# EAGLE design MOD-RGB_Rev_B (EAGLE 4.16)
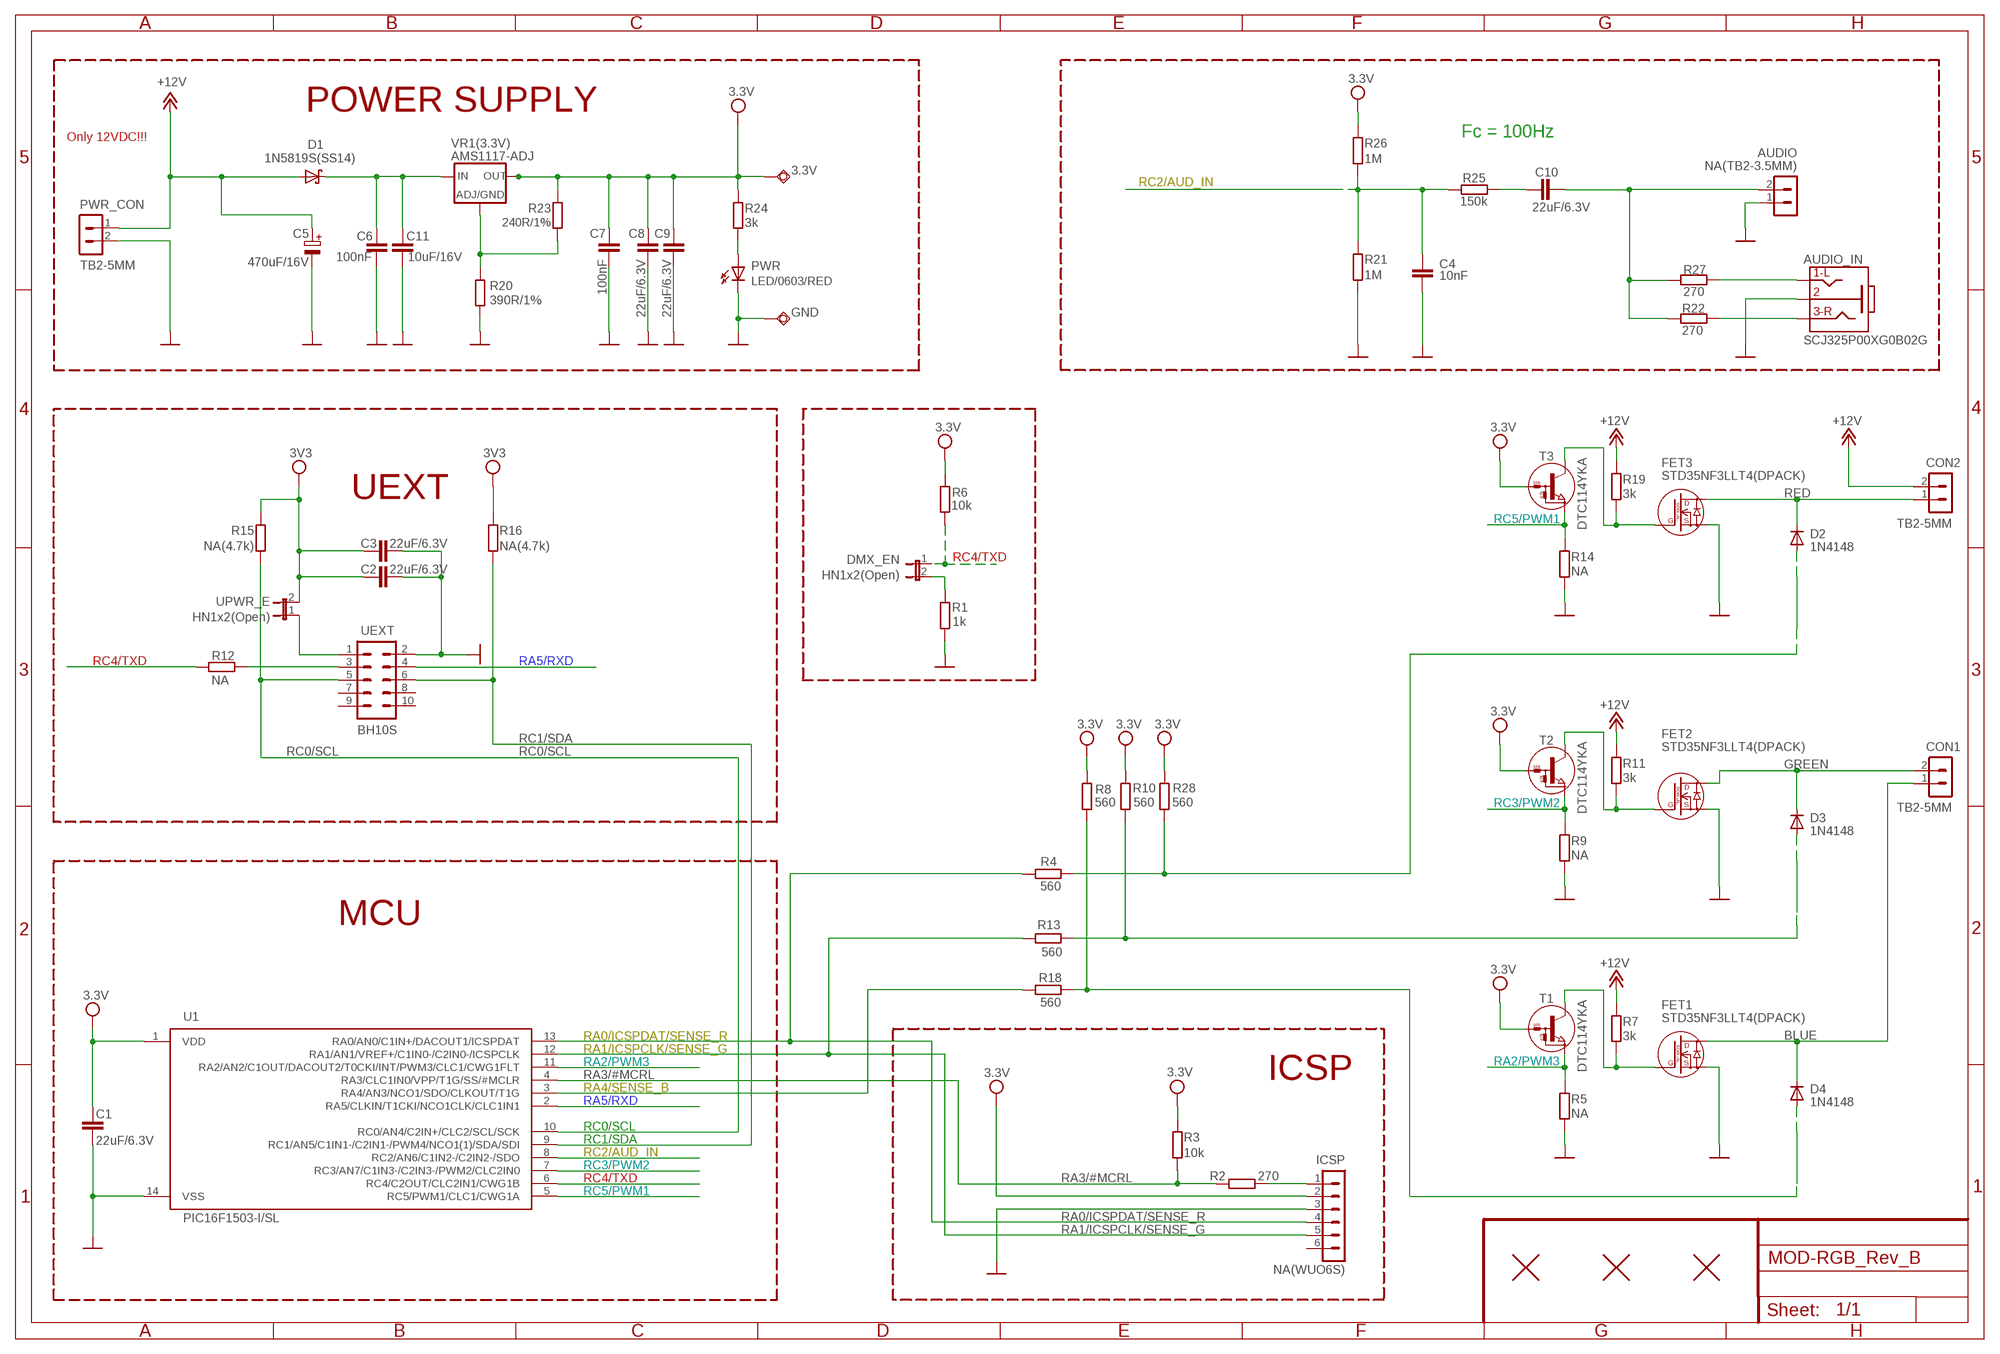
[diagram p0: schematic, sheet 1]

## Parts
3.3V  TESTPAD3  [TEST_PAD40/70/SQUARE]
AUDIO  NA(TB2-3.5MM)  CON2-DG350-3.5_2P(TB2-3.5MM)  [DG350-3.5_2P]
AUDIO_IN  SCJ325P00XG0B02G  JACK-3PINSCJ325P00XG0B02G  [PHONE_JACK-SMD]
C1  22uF/6.3V  C-EUC0603_DWS  [C0603_DWS]
C2  22uF/6.3V  C-EUC0603_DWS  [C0603_DWS]
C3  22uF/6.3V  C-EUC0603_DWS  [C0603_DWS]
C4  10nF  C-EUC0603_DWS  [C0603_DWS]
C5  470uF/16V  CP3.81MM  [3.81MMELEKTROLIT]
C6  100nF  C-EUC0603_DWS  [C0603_DWS]
C7  100nF  C-EUC0603_DWS  [C0603_DWS]
C8  22uF/6.3V  C-EUC0603_DWS  [C0603_DWS]
C9  22uF/6.3V  C-EUC0603_DWS  [C0603_DWS]
C10  22uF/6.3V  C-EUC0603_DWS  [C0603_DWS]
C11  10uF/16V  C-EUC0805_5MIL_DWS  [C0805_5MIL_DWS]
CON1  TB2-5MM  CON2-DG306-5.0_2P(TB2-5MM)  [DG306-5.0_2P]
CON2  TB2-5MM  CON2-DG306-5.0_2P(TB2-5MM)  [DG306-5.0_2P]
D1  1N5819S(SS14)  SCHOTKKY7.62SS2  [MLL-41]
D2  1N4148  DSMD  [MINI-MELF]
D3  1N4148  DSMD  [MINI-MELF]
D4  1N4148  DSMD  [MINI-MELF]
DMX_EN  HN1x2(Open)  JP1E  [JP1]
FET1  STD35NF3LLT4(DPACK)  N-MOS+DIOD/STD35NF3LLT4(DPACK)  [TO-252(DPACK)]
FET2  STD35NF3LLT4(DPACK)  N-MOS+DIOD/STD35NF3LLT4(DPACK)  [TO-252(DPACK)]
FET3  STD35NF3LLT4(DPACK)  N-MOS+DIOD/STD35NF3LLT4(DPACK)  [TO-252(DPACK)]
FID1  FIDUCIAL1X2  [FIDUCIAL-1X2]
FID2  FIDUCIAL1X2  [FIDUCIAL-1X2]
FID3  FIDUCIAL1X2  [FIDUCIAL-1X2]
GND  TESTPAD3  [TEST_PAD40/70/SQUARE]
ICSP  NA(WUO6S)  CON6WUO6S  [WU06S]
PWR  LED/0603/RED  LED0603DWS  [LED-0603]
PWR_CON  TB2-5MM  CON2-DG306-5.0_2P(TB2-5MM)  [DG306-5.0_2P]
R1  1k  R-EU_R0603_5MIL_DWS  [R0603_5MIL_DWS]
R2  270  R-EU_R0603_5MIL_DWS  [R0603_5MIL_DWS]
R3  10k  R-EU_R0603_5MIL_DWS  [R0603_5MIL_DWS]
R4  560  R-EU_R0603_5MIL_DWS  [R0603_5MIL_DWS]
R5  NA  R-EU_R0603_5MIL_DWS  [R0603_5MIL_DWS]
R6  10k  R-EU_R0603_5MIL_DWS  [R0603_5MIL_DWS]
R7  3k  R-EU_R0603_5MIL_DWS  [R0603_5MIL_DWS]
R8  560  R-EU_R0603_5MIL_DWS  [R0603_5MIL_DWS]
R9  NA  R-EU_R0603_5MIL_DWS  [R0603_5MIL_DWS]
R10  560  R-EU_R0603_5MIL_DWS  [R0603_5MIL_DWS]
R11  3k  R-EU_R0603_5MIL_DWS  [R0603_5MIL_DWS]
R12  NA  R-EU_R0603_5MIL_DWS  [R0603_5MIL_DWS]
R13  560  R-EU_R0603_5MIL_DWS  [R0603_5MIL_DWS]
R14  NA  R-EU_R0603_5MIL_DWS  [R0603_5MIL_DWS]
R15  NA(4.7k)  R-EU_R0603_5MIL_DWS  [R0603_5MIL_DWS]
R16  NA(4.7k)  R-EU_R0603_5MIL_DWS  [R0603_5MIL_DWS]
R18  560  R-EU_R0603_5MIL_DWS  [R0603_5MIL_DWS]
R19  3k  R-EU_R0603_5MIL_DWS  [R0603_5MIL_DWS]
R20  390R/1%  R-EU_R0603_5MIL_DWS  [R0603_5MIL_DWS]
R21  1M  R-EU_R0603_5MIL_DWS  [R0603_5MIL_DWS]
R22  270  R-EU_R0603_5MIL_DWS  [R0603_5MIL_DWS]
R23  240R/1%  R-EU_R0603_5MIL_DWS  [R0603_5MIL_DWS]
R24  3k  R-EU_R0603_5MIL_DWS  [R0603_5MIL_DWS]
R25  150k  R-EU_R0603_5MIL_DWS  [R0603_5MIL_DWS]
R26  1M  R-EU_R0603_5MIL_DWS  [R0603_5MIL_DWS]
R27  270  R-EU_R0603_5MIL_DWS  [R0603_5MIL_DWS]
R28  560  R-EU_R0603_5MIL_DWS  [R0603_5MIL_DWS]
T1  DTC114YKA  DIGITAL_TRANSISTORS-NPNDTC114YKA  [SOT-23]
T2  DTC114YKA  DIGITAL_TRANSISTORS-NPNDTC114YKA  [SOT-23]
T3  DTC114YKA  DIGITAL_TRANSISTORS-NPNDTC114YKA  [SOT-23]
U1  PIC16F1503-I/SL  PIC16F1503  [SOIC14]
UEXT  BH10S  ML10  [ML10-MALE]
UPWR_E  HN1x2(Open)  JP1E  [JP1]
VR1(3.3V)  AMS1117-ADJ  LM1117  [SOT223]

## Nets
+12V: C5.2(+) CON2.2 D1.A PWR_CON.1 R7.2 R11.2 R19.2
ADJ/GND: R20.2 R23.1 VR1(3.3V).1(ADJ/GND)
BLUE: CON1.1 D4.C(K) FET1.2(D)
GND: AUDIO.1 AUDIO_IN.1 C1.2 C2.2 C3.2 C4.1 C5.1(-) C6.2 C7.2 C8.2 C9.2 C11.2 FET1.3(S) FET2.3(S) FET3.3(S) GND.P$1(PP) ICSP.3 PWR.C PWR_CON.2 R1.1 R5.1 R9.1 R14.1 R20.1 R21.1 U1.14(VSS) UEXT.2
GREEN: CON1.2 D3.C(K) FET2.2(D)
N$1: FET3.1(G) R19.1 T3.3(C)
N$2: C6.1 C11.1 D1.K(C) VR1(3.3V).3(IN)
N$3: FET2.1(G) R11.1 T2.3(C)
N$4: FET1.1(G) R7.1 T1.3(C)
N$5: UEXT.1 UPWR_E.1
N$6: DMX_EN.2 R1.2
N$7: R12.1 UEXT.3
N$8: D2.A R4.1 R28.1
N$9: C10.2 R25.1
N$10: AUDIO.2 C10.1 R22.2 R27.1
N$11: AUDIO_IN.2 R22.1
N$12: AUDIO_IN.5 R27.2
N$13: ICSP.1 R2.1
N$30: PWR.A R24.1
RA0/ICSPDAT/SENSE_R: ICSP.4 R4.2 U1.13(RA0/AN0/C1IN+/DACOUT1/ICSPDAT)
RA1/ICSPCLK/SENSE_G: ICSP.5 R13.2 U1.12(RA1/AN1/VREF+/C1IN0-/C2IN0-/ICSPCLK)
RA2/PWM3: R5.2 T1.2(E) U1.11(RA2/AN2/C1OUT/DACOUT2/T0CKI/INT/PWM3/CLC1/CWG1FLT)
RA3/#MCRL: R2.2 R3.2 U1.4(RA3/CLC1IN0/VPP/T1G/SS/#MCLR)
RA4/SENSE_B: R18.2 U1.3(RA4/AN3/NCO1/SDO/CLKOUT/T1G)
RA4/SENSE_G: D3.A R10.1 R13.1
RA5/RXD: U1.2(RA5/CLKIN/T1CKI/NCO1CLK/CLC1IN1) UEXT.4
RC0/SCL: R15.1 U1.10(RC0/AN4/C2IN+/CLC2/SCL/SCK) UEXT.5
RC1/SDA: R16.1 U1.9(RC1/AN5/C1IN1-/C2IN1-/PWM4/NCO1(1)/SDA/SDI) UEXT.6
RC2/AUD_IN: C4.2 R21.2 R25.2 R26.1 U1.8(RC2/AN6/C1IN2-/C2IN2-/SDO)
RC2/SENSE_B: D4.A R8.1 R18.1
RC3/PWM2: R9.2 T2.2(E) U1.7(RC3/AN7/C1IN3-/C2IN3-/PWM2/CLC2IN0)
RC4/TXD: DMX_EN.1 R6.1 R12.2 U1.6(RC4/C2OUT/CLC2IN1/CWG1B)
RC5/PWM1: R14.2 T3.2(E) U1.5(RC5/PWM1/CLC1/CWG1A)
RED: CON2.1 D2.C(K) FET3.2(D)
VCC: 3.3V.P$1(PP) C1.1 C2.1 C3.1 C7.1 C8.1 C9.1 ICSP.2 R3.1 R6.2 R8.2 R10.2 R15.2 R16.2 R23.2 R24.2 R26.2 R28.2 T1.1(B) T2.1(B) T3.1(B) U1.1(VDD) UPWR_E.2 VR1(3.3V).2(OUT) VR1(3.3V).4(RAD) ; supply symbol labelled 3.3V, 3V3
Unconnected: ICSP.6 UEXT.7 UEXT.8 UEXT.9 UEXT.10

## Notes on the sheet
- POWER SUPPLY
- Only 12VDC!!! | Fc = 100Hz
- UEXT
- MCU
- ICSP

## Library data of the parts
3.3V GND = gogo:TESTPAD: drill 40mils, diameter 70mils
AUDIO CON1 CON2 PWR_CON = Penko:CON2
AUDIO_IN = gogo:JACK-3PIN
C1-C4 C6-C11 = rcl:C-EU: CAPACITOR, European symbol
C5 = DOUBLE-SIDE:CP: POLARIZED CAPACITOR
D1 = gogo:SCHOTKKY7.62SS
D2-D4 = DOUBLE-SIDE:D: DIODES
DMX_EN UPWR_E = jumper:JP1E: JUMPER
FET1-FET3 = Penko:N-MOS+DIOD
FID1-FID3 = SparkFunEagle-6-6-07:FIDUCIAL: Fiducial Alignment Points Various fiducial points for machine vision alignment.
ICSP = Penko:CON6: CONNECTORS - 6 PINS
PWR = DOUBLE-SIDE:LED
R1-R16 R18-R28 = rcl:R-EU_: RESISTOR, European symbol
T1-T3 = OLIMEX_DISCRET:DIGITAL_TRANSISTORS-NPN: DTC114YKA Digital Transistor - NPN
U1 = OLIMEX_IC:PIC16F1503
UEXT = con-harting-ml:ML10: HARTING
VR1(3.3V) = arm:LM1117

## Net classes
1 PWR: width 0.203 mm, drill 0.076 mm, clearance 0.4 mm

## Board
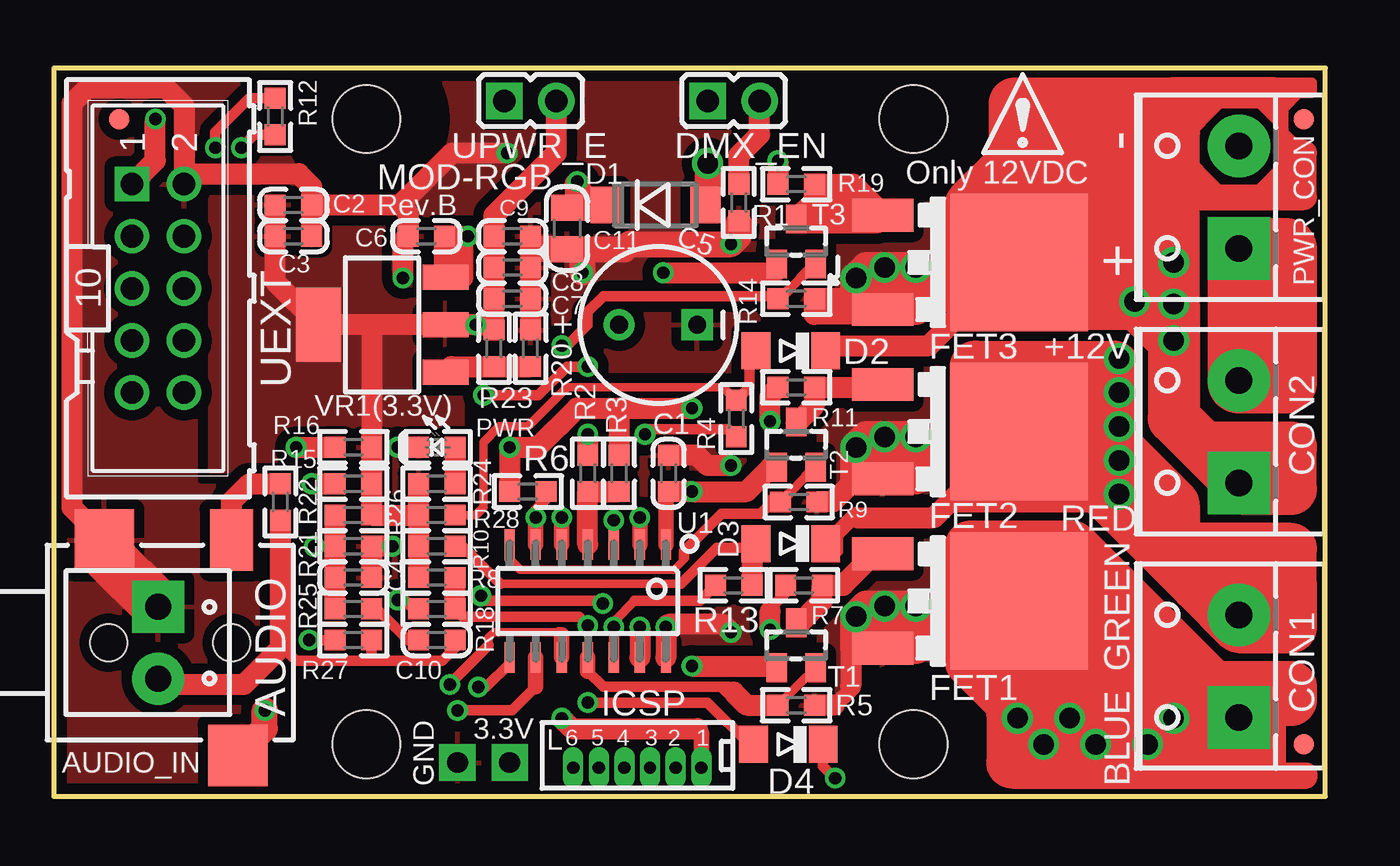
[diagram p1: board, top side]
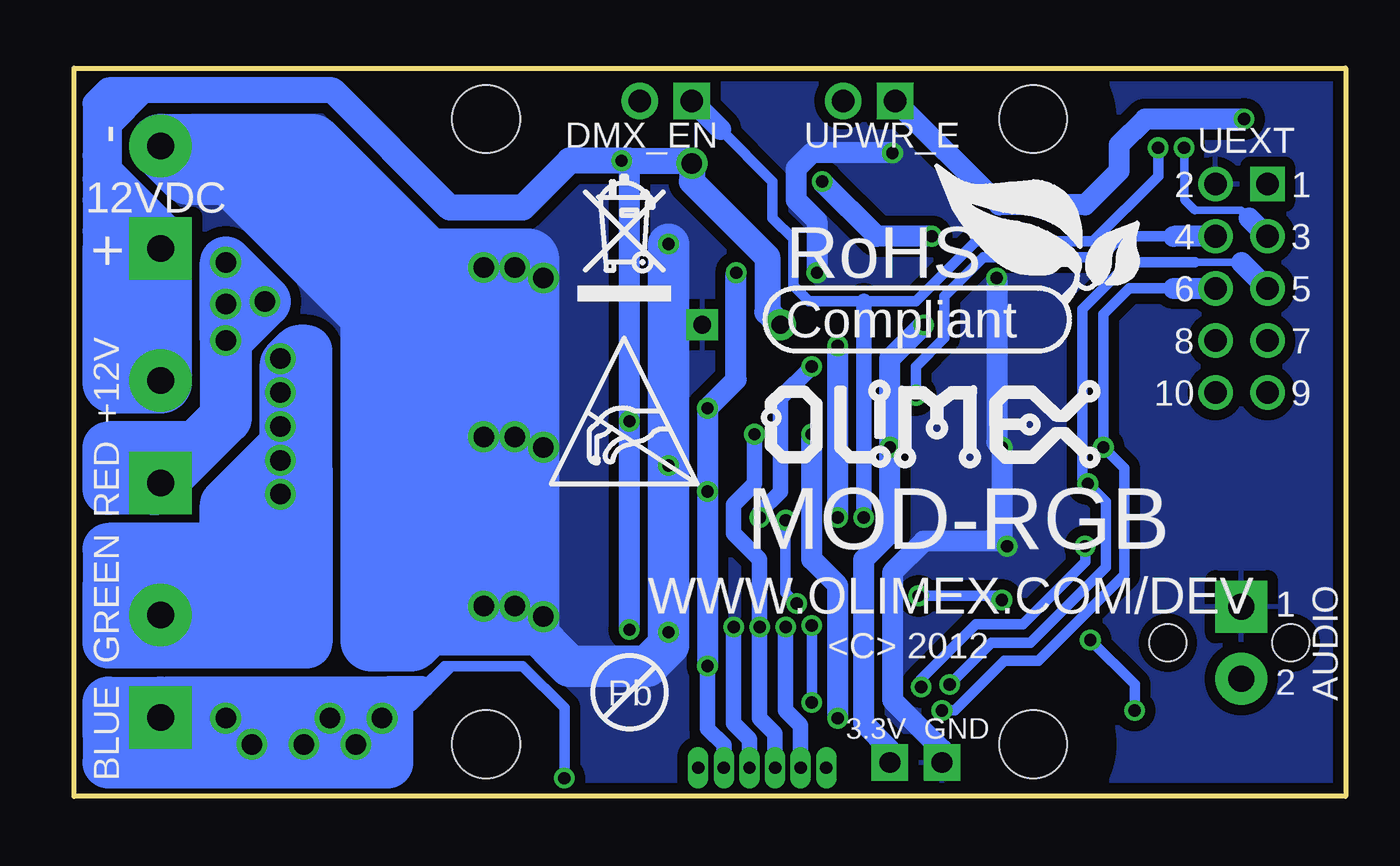
[diagram p2: board, bottom side, seen from below]

Size 62 x 35.5 mm. Coordinates in mm from the lower left corner, seen from the top.
Outline: 0,0 62,0 62,35.5 0,35.5 0,0
Copper layers (1+16): Top 0.035mm / dielectric 1.5mm / Bottom 0.035mm
Design rules "default": minimum track width 10mil, minimum drill 23mil, track to track 10mil, track to pad 10mil, pad to pad 10mil, via to via 10mil, smd to smd 1mil, copper to edge 10mil, drill to drill 8mil, minimum pad ring 8mil, minimum via ring 8mil, stop-mask expansion 4mil, vias tented up to drill 30mil, thermal gap 20mil
Holes 3.3 mm at 15.24,33.02 15.24,2.54 41.91,33.02 41.91,2.54
tRestrict: area 11.8,-0.9 to 18.7,6; area 11.8,29.6 to 18.7,36.4; area 38.5,29.6 to 45.3,36.4; area 38.5,-0.9 to 45.3,6
bRestrict: area 11.8,-0.9 to 18.7,6; area 11.8,29.6 to 18.7,36.4; area 38.5,29.6 to 45.3,36.4; area 38.5,-0.9 to 45.3,6; 1 lines

### Footprints (pad centres in the part's own frame; a part is rotated, then mirrored left to right if it is on the bottom)
TEST_PAD40/70/SQUARE = drill 1.016 pad 1.778 square: P$1 0,0
DG350-3.5_2P = drill 1.27 pad 2.54 square: 1 -1.75,0 | drill 1.27 pad 2.54 round: 2 1.75,0
PHONE_JACK-SMD = smd 2.9 x 3: 1 -0.2,5; 5 6.3,-5.5 | smd 2.1 x 3: 2 6,5 | hole 1.8: 0,0; 6,0
C0603_DWS = smd 1.016 x 1.016: 1 -0.889,0; 2 0.889,0
3.81MMELEKTROLIT = drill 0.864 pad 1.524 square: 1 -1.27,0 | drill 0.864 pad 1.524 round: 2 2.54,0
C0805_5MIL_DWS = smd 1.27 x 1.524: 1 -1.016,0; 2 1.016,0
DG306-5.0_2P = drill 1.3 pad 3.048 square: 1 -2.5,0 | drill 1.3 pad 3.048 round: 2 2.5,0
MLL-41 = smd 1.45 x 1.8: A 2.445,0; K -2.445,0
MINI-MELF = smd 1.4 x 1.8: A 1.7,0; C -1.7,0
JP1 = drill 1.1 pad 1.778 square: 1 0,-1.27 | drill 1.1 pad 1.778 round: 2 0,1.27
TO-252(DPACK) = smd 1.6 x 3: 1 -2.3,-1.5; 3 2.3,-1.5 | smd 6.7 x 6.7: 2 0,5.15
FIDUCIAL-1X2 = smd 1 x 1: 1 0,0
WU06S = drill 0.6 pad 0.991 long: 1 -3.125,0; 2 -1.875,0; 3 -0.625,0; 4 0.625,0; 5 1.875,0; 6 3.125,0
LED-0603 = smd 1.016 x 1.016: A 0.889,0; C -0.889,0
R0603_5MIL_DWS = smd 1.016 x 1.016: 1 -0.889,0; 2 0.889,0
SOT-23 = smd 1 x 1.4: 1 -0.95,-1.1; 2 0.95,-1.1; 3 0,1.1
SOIC14 = smd 0.5 x 1.5: 1 -3.81,-2.75; 2 -2.54,-2.75; 3 -1.27,-2.75; 4 0,-2.75; 5 1.27,-2.75; 6 2.54,-2.75; 7 3.81,-2.75; 8 3.81,2.75; 9 2.54,2.75; 10 1.27,2.75; 11 0,2.75; 12 -1.27,2.75; 13 -2.54,2.75; 14 -3.81,2.75
ML10-MALE = drill 1.1 pad 1.676 square: 1 -5.08,-1.27 | drill 1.1 pad 1.676 round: 2 -5.08,1.27; 3 -2.54,-1.27; 4 -2.54,1.27; 5 0,-1.27; 6 0,1.27; 7 2.54,-1.27; 8 2.54,1.27; 9 5.08,-1.27; 10 5.08,1.27
SOT223 = smd 1.219 x 2.235: 1 -2.311,-3.099; 2 0,-3.099; 3 2.311,-3.099 | smd 3.6 x 2.2: 4 0,3.099

### Placement (x,y rotation side)
3.3V  22.23,1.65 180 top
AUDIO  5.08,7.49 270 top
AUDIO_IN  2.67,7.49 0 top
C1  29.97,15.75 90 top
C2  11.68,28.83 0 top
C3  11.68,27.3 0 top
C4  14.61,10.67 180 top
C5  30.1,22.99 180 top
C6  18.16,27.3 180 top
C7  22.35,24.26 0 top
C8  22.35,25.78 0 top
C9  22.35,27.3 0 top
C10  18.67,7.62 180 top
C11  25.02,27.69 270 top
CON1  57.78,6.35 90 top
CON2  57.78,17.78 90 top
D1  29.34,28.83 0 top
D2  35.94,21.72 180 top
D3  35.94,12.32 180 top
D4  35.81,2.54 180 top
DMX_EN  33.15,33.91 270 top
FET1  41.91,9.53 270 top
FET2  41.91,17.78 270 top
FET3  41.91,26.04 270 top
FID1  3.17,33.02 0 top
FID2  60.96,2.54 0 top
FID3  60.96,33.02 0 top
GND  19.68,1.65 180 top
ICSP  28.45,1.4 180 top
PWR  18.67,17.02 0 top
PWR_CON  57.78,29.21 90 top
R1  33.4,28.96 90 top
R2  26.04,15.75 270 top
R3  27.56,15.75 270 top
R4  33.27,18.41 270 top
R5  36.2,4.45 180 top
R6  23.11,14.86 180 top
R7  36.58,10.29 180 top
R8  18.67,10.67 180 top
R9  36.32,14.35 180 top
R10  18.67,12.19 180 top
R11  36.2,19.94 180 top
R12  10.79,33.15 270 top
R13  33.15,10.29 180 top
R14  36.2,24.26 180 top
R15  14.61,15.24 0 top
R16  14.61,17.02 0 top
R18  18.67,9.14 180 top
R19  36.2,29.84 180 top
R20  23.24,21.84 270 top
R21  14.61,12.19 180 top
R22  11.05,14.35 270 top
R23  21.46,21.84 90 top
R24  18.67,15.24 180 top
R25  14.61,9.14 180 top
R26  14.61,13.72 0 top
R27  14.61,7.62 180 top
R28  18.67,13.72 180 top
T1  36.2,7.37 0 top
T2  36.2,17.14 0 top
T3  36.2,27.05 0 top
U1  26.04,9.53 180 top
U$1  [ESD_SYMBOL]  38.73,15.24 0 bottom
U$2  [RECYCLE_BIN1/8]  37.47,24.13 0 bottom
U$3  [PB_SMALL]  34.92,5.08 0 bottom
U$4  [OLIMEX1_V]  10.79,15.88 0 bottom
U$5  [ATTENTION]  45.34,31.37 0 top
U$6  [ROHS]  27.3,22.35 0 bottom
UEXT  5.08,24.77 270 top
UPWR_E  23.24,33.91 270 top
VR1(3.3V)  16,22.99 90 top

### Tracks (layer width: path | path; a pad name or v marks a point on that pad's centre or on a via)
+12V  (via drill 0.6, 1)
  Top 0.508: 34.92,9.02 34.92,9.14 35.69,9.91 R7.2
  Top 1.016: v35.31,30.99 R19.2 | v34.92,8.13 34.92,9.02 | v34.92,18.29 34.92,19.56 R11.2
  Top 1.27: D1.A 31.88,28.73 v31.88,30.86
  Top 3.048: PWR_CON.1 57.78,26.67 | 57.78,20.19 57.78,26.67 | CON2.2 57.78,20.19 | 57.78,26.67 60.07,26.67 60.07,20.19 57.78,20.19
  Bottom 1.016: v34.92,8.13 v34.92,18.29 34.92,30.99
  Bottom 1.27: 60.07,26.42 60.96,26.42 60.96,27.56 | 60.96,31.24 60.96,30.1 | 60.96,30.1 60.96,29.08 | 60.96,29.08 60.96,27.56 | 60.33,34.42 60.96,33.78 60.96,31.24 | 58.67,34.42 49.4,34.42 43.69,28.7 40.13,28.7 37.85,30.99 v35.31,30.99 34.92,30.99 32,30.99 v31.88,30.86 31.88,29.97 28.19,26.29 28.19,23.62 C5.2 | 58.67,34.42 60.33,34.42 | 60.96,27.56 59.44,27.56 60.96,29.08 | 60.96,30.1 58.29,27.43 | 60.33,30.61 60.96,31.24 | 60.33,30.61 56.9,27.18 | 60.33,34.42 60.33,32.77 | 60.33,32.77 60.33,30.61 | 58.67,34.42 60.33,32.77
  Bottom 3.048: 57.78,26.67 PWR_CON.1 | 57.78,20.19 57.78,26.67 | 57.78,20.19 CON2.2 | 57.78,26.67 60.07,26.67 60.07,26.42 60.07,20.19 57.78,20.19
ADJ/GND
  Top 1.016: VR1(3.3V).1 19.38,20.95 R23.1 R20.2
BLUE  (via drill 0.6, 1)
  Top 0.508: D4.C 37.51,1.48 v38.1,0.89
  Top 1.016: 58.8,1.65 58.8,1.14 | 58.8,1.14 61.09,1.14 61.09,0.89 58.8,0.89 58.8,1.14 | 46.74,4.06 v46.99,3.81
  Top 2.54: CON1.1 52.11,9.53 FET1.2 44.7,9.53 44.7,9.65 | 44.7,9.65 44.7,12.19 49.66,12.19 54.1,7.75 | 54.1,7.75 55.63,6.22 | 55.63,6.22 56.52,5.33 60.33,5.33 60.33,4.7 58.8,4.7 58.8,4.06 | 58.8,4.06 58.8,1.65 46.74,1.65 46.74,4.06 | 45.09,6.22 44.7,6.6 44.7,9.65 | 45.09,6.22 46.74,4.57 46.74,4.06 | 54.1,7.75 48.39,7.75 | 45.09,6.22 55.63,6.22 | 46.74,4.06 58.8,4.06
  Bottom 0.508: 44.96,5.33 43.94,6.35 43.59,6.35 | 43.59,6.35 40.13,6.35 38.1,4.32 v38.1,0.89 | 43.59,6.35 44.6,5.33 | v53.34,2.54 v50.8,2.54 v48.26,2.54 | v46.99,3.81 v49.53,3.81 53.34,3.81 v53.34,2.54 | v53.34,2.54 56.52,2.54
  Bottom 1.016: 46.86,4.57 45.72,4.57 44.96,5.33 46.74,5.33 46.74,4.7
  Bottom 2.54: CON1.1 57.78,4.57 60.33,4.57 60.33,3.05 | 60.33,3.05 60.33,1.65 46.74,1.65 46.74,3.05 | 46.74,3.05 46.74,4.57 46.86,4.57 57.4,4.57 | 46.74,3.05 54.61,3.05 | 54.61,3.05 v54.61,3.81 | 54.61,3.05 60.33,3.05
GND  (via drill 0.6, 1)
  Top 0.508: v16.76,17.02 PWR.C
  Top 0.762: 38.05,4.45 38.1,4.45 38.86,5.21 38.86,5.38
  Top 1.016: 38.05,4.45 R5.1 | 39.12,7.22 39.12,7.24 38.86,7.24 38.86,5.38 | 39.12,15.48 37.99,14.35 R9.1 | 38.61,24.26 R14.1 37.08,23.5 42.04,23.5 42.04,23.75 | 39.12,24.26 38.61,24.26 | 38.61,24.26 38.61,23.75 | v29.84,8.26 U1.14 v29.84,8.26 | 33.4,27.94 R1.1 | 23.37,26.67 23.24,26.67 | v33.02,16.13 31.88,16.13 31.37,16.64 C1.2 | v33.02,8 32.64,8.38 29.97,8.38 v29.84,8.26 | 23.24,26.67 C9.2 | 23.24,26.67 C8.2 C7.2 R20.1 | v22.1,31.37 19.43,31.37 16.89,28.83 | C2.2 C3.2 | C2.2 12.57,29.72 11.94,30.35 6.35,30.35 | 6.35,30.35 UEXT.2 | AUDIO_IN.1 0.89,14.07 0.89,33.78 1.65,34.54 5.46,34.54 6.35,33.66 6.35,30.35 | v17.02,25.27 17.02,27.05 C6.2 17.27,28.45 16.89,28.83 | C4.1 R21.1 v16.51,12.19 | C2.2 16.89,28.83
  Top 1.27: v25.78,25.53 25.78,26.67 | 25.78,26.67 27.81,26.67 28.07,26.92 v33.02,26.92 33.4,27.3 33.4,27.94 | 25.78,26.67 C11.2 23.37,26.67
  Top 1.524: 40.77,7.22 FET1.3 | 40.77,7.22 42.04,7.22 v42.04,9.27 40.77,9.27 | 40.77,7.22 39.88,7.22 | 39.88,7.22 39.12,7.22 v39.12,8.76 39.62,9.27 39.88,9.27 | 39.88,9.27 v40.51,9.27 40.77,9.27 | 40.77,9.27 40.77,7.22 | 39.88,9.27 39.88,7.22 | 40.77,15.48 FET2.3 | 40.77,15.48 42.04,15.48 v42.04,17.53 40.77,17.53 | 40.77,15.48 39.88,15.48 | 39.88,15.48 39.12,15.48 v39.12,17.02 39.62,17.53 39.88,17.53 | 39.88,17.53 v40.51,17.53 40.77,17.53 | 40.77,17.53 40.77,15.48 | 39.88,17.53 39.88,15.48 | 40.77,23.73 FET3.3 | 40.77,23.73 42.04,23.73 42.04,23.75 v42.04,25.78 40.77,25.78 | 40.77,23.73 39.88,23.73 | 39.88,23.73 39.12,23.73 39.12,24.26 v39.12,25.27 39.62,25.78 39.88,25.78 | 39.88,25.78 v40.51,25.78 40.77,25.78 | 40.77,25.78 40.77,23.73 | 39.88,25.78 39.88,23.73
  Top 2.54: AUDIO.1 5.08,9.27 2.47,11.88 AUDIO_IN.1
  Bottom 0.508: 16.76,12.45 v16.51,12.19
  Bottom 0.762: ICSP.3 29.07,2.78 29.84,3.56 v29.84,8.26
  Bottom 1.016: v22.1,31.37 26.04,31.37 26.8,30.61 26.8,29.08 25.78,28.07 v25.78,25.53 | GND.P$1 19.68,2.29 22.1,4.7 22.1,10.92 20.57,12.45 16.76,12.45 v16.76,17.02 17.02,17.27 v17.02,25.27
  Bottom 1.524: v42.04,17.53 v40.51,17.53 39.62,17.53 v39.12,17.02 42.04,17.02 | v42.04,25.78 v40.51,25.78 39.88,25.78 39.62,25.78 v39.12,25.27 42.04,25.27 | 33.02,22.99 C5.1 | v42.04,9.27 v40.51,9.27 39.62,9.27 v39.12,8.76 42.04,8.76 v42.04,9.27
  Bottom 2.032: v33.02,26.92 33.02,22.99 v33.02,16.13 v33.02,8 33.02,7.37 34.04,6.35 37.85,6.35 39.88,8.38
  Bottom 2.54: 57.78,31.75 PWR_CON.2 | 42.04,17.02 v42.04,17.53
  Bottom 3.048: 39.88,26.16 39.88,25.78 v42.04,25.78 42.04,25.27 v42.04,17.53 | 39.88,26.16 44.83,26.16 | 44.83,26.16 50.42,31.75 57.78,31.75 56.39,30.35 54.36,30.35 | 42.04,17.02 v42.04,9.27 42.04,8.38 | 42.04,8.38 39.88,8.38 39.88,26.16 | 42.04,8.38 44.83,8.38 | 44.83,8.38 44.83,20.83 | 44.83,20.83 44.83,23.24 | 44.83,26.16 44.83,23.24 | 44.83,23.24 53.09,31.5 | 44.83,20.83 47.5,23.5 | 47.5,23.5 54.36,30.35 | 54.36,30.35 55.5,31.5 | 44.83,8.38 45.59,7.62 47.5,7.62 47.5,23.5
  pour Bottom (isolate 0.508, rank 3): -4.83,37.08 64.52,37.08 64.52,-2.54 -4.83,-2.54
  pour Top (isolate 0.508, rank 3): -3.81,35.81 65.15,35.81 65.15,-1.27 -3.81,-1.27
GREEN  (via drill 1)
  Top 0.508: 38.23,12.7 38.23,11.94 | 38.23,12.7 38.23,13.06 38.76,13.59 39.12,13.59 38.23,12.7 | D3.C 37.85,12.32 38.23,12.7
  Top 1.016: 44.96,15.11 44.45,15.11 43.69,14.35 | 39.12,13.59 42.93,13.59 43.69,14.35 | 43.69,14.35 44.96,14.35
  Top 2.54: CON1.2 48.85,17.78 FET2.2 44.96,17.78 44.96,18.03 | 44.96,18.03 44.96,20.95 51.69,20.95 51.69,17.14 54.61,14.22 54.61,12.7 55.24,12.06 60.33,12.06 60.33,10.29 | 60.33,10.29 60.33,8.26 57.78,8.26 55.75,10.29 | 55.75,10.29 50.93,15.11 44.96,15.11 44.96,18.03 | 55.75,10.29 60.33,10.29
  Bottom 1.016: v51.94,21.34 v51.94,19.68 v51.94,18.03 v51.94,16.38 v51.94,14.73
  Bottom 2.54: CON1.2 54.61,12.03 54.61,12.06 | 54.61,12.06 54.61,14.22 51.69,17.14 51.69,21.08 51.05,21.72 50.67,21.72 50.67,16 | 50.67,16 50.67,12.06 | 50.67,8.89 52.7,8.89 | 52.7,8.89 53.98,8.89 | 53.98,8.89 57.78,8.89 | 50.67,16 v51.94,14.73 54.61,12.06 | 50.67,12.06 50.67,8.89 | 50.67,12.06 52.7,12.06 | 50.67,8.89 50.67,7.49 60.33,7.49 60.33,10.29 | 60.33,10.29 60.33,12.06 52.7,12.06 | 52.7,12.06 52.7,10.29 | 52.7,10.29 52.7,8.89 | 53.98,8.89 53.98,13.72 | 52.7,10.29 60.33,10.29
N$1
  Top 1.016: FET3.1 40.5,28.34 40.13,28.7 | 39.5,29.34 38.99,29.84 R19.1 37.08,29.34 | 39.5,29.34 40.13,28.7 | T3.3 37.08,29.04 37.08,29.34 | 40.13,28.7 40.13,27.94 36.2,27.94 | 40.13,28.7 36.96,28.7 | 37.08,29.34 39.5,29.34
N$2  (via drill 0.6)
  Top 1.016: v25.53,29.97 25.53,29.79 | 25.53,28.7 C11.1 | 19.94,27.3 C6.1 19.05,25.3 VR1(3.3V).3 | 19.94,27.3 v20.19,27.3 | 19.94,27.3 19.94,25.3
  Top 1.27: 25.53,29.79 25.53,28.7 26.89,28.7 D1.K
  Bottom 1.016: v25.53,29.97 22.86,27.3 v20.19,27.3
N$3
  Top 1.016: T2.3 36.2,18.16 37.08,19.05 R11.1 40.27,19.94 FET2.1
N$4
  Top 1.016: FET1.1 40.02,11.82 38.48,10.29 R7.1 37.47,9.53 36.2,8.26 T1.3
N$5  (via drill 0.6)
  Top 1.016: UEXT.1 4.95,30.99 v4.95,33.02
  Bottom 1.016: v4.95,33.02 9.78,33.02 11.05,31.75 11.05,30.48 12.7,28.83 16.89,28.83 UPWR_E.1
N$6
  Top 1.016: R1.2 33.4,31.24 34.42,32.26 DMX_EN.2
N$7  (via drill 0.6)
  Top 0.508: v7.87,31.62 7.87,32.38 9.53,34.04 R12.1
  Bottom 0.356: 4.7,28.19 5.08,28.57 7.37,28.57
  Bottom 0.406: 7.37,28.57 7.87,29.08 v7.87,31.62
  Bottom 1.016: UEXT.3 4.7,28.19
N$8
  Top 0.406: R4.1 32.64,19.94 25.02,19.94 23.11,18.03 21.72,18.03 20.95,17.27 20.95,14.1 20.57,13.72 R28.1
  Top 0.508: R4.1 33.91,19.94 33.91,21.08 34.24,21.41 D2.A
N$9
  Top 0.508: R25.1 15.75,9.14 17.27,7.62 C10.2
N$10
  Top 0.508: 11.05,7.37 11.81,6.6 15.49,6.6 | 15.49,6.6 R27.1 | C10.1 19.56,7.24 18.92,6.6 15.49,6.6
  Top 1.016: AUDIO.2 5.36,5.46 9.27,5.46 11.05,7.24 11.05,7.37 R22.2
N$11
  Top 1.016: AUDIO_IN.2 8.67,14.38 9.53,15.24 R22.1
N$12  (via drill 0.6)
  Top 0.508: v12.45,7.62 R27.2
  Top 1.27: AUDIO_IN.5 10.29,3.31 v10.29,4.19
  Bottom 0.508: v12.45,7.62 10.29,5.46 v10.29,4.19
N$13  (via drill 0.6)
  Top 0.762: ICSP.1 31.57,3.1 31.37,3.3
  Top 1.016: v24.77,3.81 25.27,3.3 31.37,3.3 | v26.04,17.65 R2.1
  Bottom 1.016: v24.77,3.81 24.77,10.29 26.04,11.56 v26.04,17.65
N$30
  Top 1.016: PWR.A R24.1
RA0/ICSPDAT/SENSE_R  (via drill 0.6)
  Top 0.508: v28.83,17.65 29.08,17.91 32.89,17.91 R4.2
  Top 1.016: v28.57,8.26 U1.13
  Bottom 0.762: ICSP.4 27.82,3.06 28.57,3.81 v28.57,8.26 28.57,11.56 29.84,12.83 29.84,14.22 28.83,15.24 v28.83,17.65
RA1/ICSPCLK/SENSE_G  (via drill 0.6)
  Top 0.406: 27.3,8.51 28.32,9.53
  Top 0.508: 27.3,8.51 v27.3,8.26 U1.12 | 28.32,9.53 31.5,9.53 R13.2
  Bottom 0.762: ICSP.5 26.57,3.46 27.3,4.19 v27.3,8.26
RA2/PWM3
  Top 0.406: R5.2 36.7,5.84 37.08,5.84
  Top 0.508: 37.08,5.84 37.08,6.21 T1.2 | 26.04,6.1 26.8,5.33 32.54,5.33 | 32.54,5.33 32.89,5.33 33.15,5.08 | 32.54,5.33 32.79,5.08
  Top 0.762: U1.11 26.04,6.1
  Top 1.016: 33.15,5.08 33.78,4.45 R5.2
RA3/#MCRL
  Top 1.016: R3.2 R2.2 U1.4
RA4/SENSE_B  (via drill 0.6)
  Top 0.508: v16.76,9.58 17.09,9.58 17.53,9.14 R18.2 | v20.83,9.78 21.08,9.53 26.64,9.53 v26.77,9.4 | v27.3,13.46 U1.3
  Bottom 0.508: v16.76,9.58 16.97,9.78 v20.83,9.78 | v26.77,9.4 27.3,9.93 v27.3,13.46
RA4/SENSE_G
  Top 0.406: 21.77,10.36 30.58,10.36
  Top 0.508: 34.04,12.11 32.33,12.11 30.58,10.36 | 21.77,10.36 19.94,12.19 R10.1
  Top 1.016: D3.A 34.04,12.11 R13.1
RA5/RXD  (via drill 0.6)
  Top 0.508: v26.04,20.95 25.02,20.95 23.62,19.56 v20.95,19.56
  Top 0.762: v28.57,13.59 U1.2
  Bottom 0.508: 8.38,27.3 10.92,27.3 11.94,26.29 17.65,26.29 19.56,24.38 19.56,22.35 20.95,20.95 v20.95,19.56
  Bottom 0.762: v26.04,20.95 27.56,19.43 27.56,14.86 28.57,13.84 v28.57,13.59
  Bottom 1.016: UEXT.4 8.38,27.3
RC0/SCL  (via drill 0.6)
  Top 0.406: 24.64,8 21.46,8 21.21,7.75 21.21,7.37
  Top 0.508: 24.64,8 24.77,7.87 | v19.3,5.46 21.21,7.37
  Top 0.762: 24.77,7.87 U1.10
  Top 1.016: v12.57,15.24 R15.1
  Bottom 0.356: 7.37,26.04 5.08,26.04
  Bottom 0.508: v19.3,5.46 17.27,7.49 15.37,7.49 11.68,11.18 11.68,14.35 v12.57,15.24 12.83,15.49 12.83,23.75 10.54,26.04 7.37,26.04
  Bottom 1.016: 5.08,26.04 UEXT.5
RC1/SDA  (via drill 0.6)
  Top 0.508: v19.68,4.19 22.35,4.19 23.5,5.33
  Top 0.762: 23.5,5.33 U1.9
  Top 1.016: v11.81,17.02 R16.1
  Bottom 0.508: v19.68,4.19 19.05,4.19 16.64,6.6 14.99,6.6 10.79,10.79 10.79,16 v11.81,17.02 11.81,23.5 10.54,24.77 8.38,24.77
  Bottom 1.016: 8.38,24.77 UEXT.6
RC2/AUD_IN  (via drill 0.6)
  Top 0.508: U1.8 22.23,6.48 21.08,5.33 v20.7,5.33 | R21.2 v12.7,12.19
  Top 1.016: R26.1 R21.2 C4.2 R25.2
  Bottom 0.508: v20.7,5.33 20.7,5.71 18.03,8.38 15.75,8.38 12.7,11.43 v12.7,12.19
RC2/SENSE_B  (via drill 0.6)
  Top 0.508: D4.A 33.91,2.54 31.88,4.57 v26.04,4.57 | R18.1 19.94,8.76 25.6,8.76 v26.04,8.33
  Top 1.016: R18.1 R8.1
  Bottom 0.508: v26.04,8.33 v26.04,4.57
RC3/PWM2
  Top 0.356: 30.25,11.05 30.73,11.53 30.73,11.63
  Top 0.406: 35.81,14.73 36.7,15.62 | 22.23,11.56 22.73,11.05 30.25,11.05
  Top 0.508: T2.2 37.15,16.06 36.7,15.62 | R9.2 35.81,14.73 | 35.05,14.35 34.47,13.77 32.56,13.77 30.73,11.94 30.73,11.63 | U1.7 22.23,11.56
  Top 0.762: 35.05,14.35 R9.2
RC4/TXD  (via drill 0.6)
  Top 0.508: R6.1 24,14.48 23.5,13.97 v23.5,13.59 | v9.14,31.62 9.78,32.26 R12.2
  Top 0.762: U1.6 v23.5,13.59
  Bottom 0.508: 30.48,32.51 27.94,29.97 27.94,28.19 26.92,27.18 26.92,24.89 26.16,24.13 23.5,24.13 20.95,24.13 18.03,27.05 12.32,27.05 9.14,30.23 v9.14,31.62
  Bottom 0.762: v23.5,13.59 23.5,24.13
  Bottom 1.016: 30.48,32.51 DMX_EN.1
RC5/PWM1  (via drill 0.6)
  Top 0.406: 35.79,24.64 36.42,25.27
  Top 0.508: T3.2 37.1,25.95 36.42,25.27 | 35.79,24.64 35.41,24.26 R14.2 35.18,24.26 35.05,24.38 26.8,24.38 26.04,23.62 26.04,22.99 25.02,21.97 v24.77,21.97
  Top 0.762: U1.5 v24.77,13.59
  Bottom 1.016: v24.77,13.59 v24.77,21.97
RED  (via drill 1)
  Top 0.508: 59.94,30.23 59.94,32.38 | 59.94,32.38 59.94,32.64 | 59.94,32.64 59.94,33.27 | 59.94,33.27 59.94,33.53 | 59.94,34.29 59.94,33.53 | 59.44,34.29 59.94,34.29 | 59.94,32.38 60.71,31.62 | 58.93,34.29 59.94,33.27 | 58.29,34.29 59.94,32.64 | 59.69,34.8 61.34,34.8 61.34,34.29 60.71,34.29 | 59.94,34.29 60.71,34.29 | 59.94,33.53 60.71,34.29
  Top 1.016: 44.7,24 42.67,21.97 37.9,21.97 D2.C
  Top 1.27: 54.61,29.21 56.64,29.21 | 56.64,29.21 58.93,29.21 | 58.93,29.21 60.33,29.21 | 60.33,29.21 60.96,29.21 60.96,31.37 60.33,31.37 60.33,30.61 | 54.61,31.24 56.64,29.21 | 60.33,29.21 60.33,30.61 | 58.93,29.21 59.94,30.23 60.33,30.61
  Top 1.524: 54.61,33.78 54.61,34.29 56.64,34.29 | 56.64,34.29 58.29,34.29 58.93,34.29 59.44,34.29 | 54.61,32.26 56.64,34.29
  Top 2.54: 46.86,26.04 FET3.2 | 46.86,26.04 49.15,26.04 | 49.15,26.04 51.31,26.04 | 51.31,26.04 52.96,26.04 | v54.61,26.04 52.96,26.04 | v54.61,26.04 54.61,29.21 54.61,31.24 54.61,32.26 54.61,33.78 52.96,33.78 | 51.31,33.78 52.96,33.78 | 49.15,33.78 51.31,33.78 | 49.15,33.78 46.86,33.78 46.86,30.99 | 46.86,30.99 46.86,26.04 | v54.61,22.23 54.61,18.45 CON2.1 58.08,14.99 58.17,14.99 | v54.61,24 v54.61,22.23 | v54.61,24 v54.61,26.04 | 49.02,24 47.06,24 | 49.02,24 52.83,24 | 52.83,24 v54.61,24 | 52.83,24 v54.61,22.23 | 49.15,33.78 49.15,26.04 | 51.31,26.04 51.31,33.78 | 52.96,26.04 52.96,33.78 | 46.86,30.99 44.7,28.83 44.7,24 49.02,24 | 58.17,14.99 56.13,17.02 60.33,17.02 60.33,14.99 58.17,14.99
  Bottom 2.54: v54.61,22.23 54.61,18.45 CON2.1 57.78,15.24 58.04,14.99 58.17,14.99 | v54.61,22.23 v54.61,26.04 v52.7,24.13 v54.61,22.23 | 58.17,14.99 60.33,14.99 60.33,17.02 56.13,17.02 58.17,14.99
VCC  (via drill 0.6)
  Top 0.508: R28.2 17.78,13.59
  Top 0.762: C1.1 29.84,14.73 U1.1
  Top 1.016: v31.11,6.35 35.16,6.35 T1.1 | C1.1 v31.11,14.86 33.78,14.86 34.97,16.05 T2.1 | v29.72,25.53 35.12,25.53 35.24,25.65 T3.1 | 27.56,18.92 R3.1 | 27.56,18.92 v31.11,18.92 | 27.56,18.92 25.5,18.92 23.6,17.02 v22.23,17.02 R6.2 | UPWR_E.2 24.51,31.37 21.46,28.32 C9.1 C8.1 C7.1 R23.2 21.46,22.99 v20.57,22.99 VR1(3.3V).2 15.75,22.99 | C2.1 C3.1 10.79,25.09 VR1(3.3V).4 15.75,22.99 | 15.75,22.99 15.49,22.73 R16.2 R15.2 R26.2 R28.2 | R28.2 R24.2 | R28.2 R10.2 R8.2
  Bottom 0.762: ICSP.2 30.32,2.51 31.11,3.3 v31.11,6.35
  Bottom 1.016: v31.11,6.35 v31.11,14.86 v31.11,18.92 29.72,20.32 v29.72,25.53 | 3.3V.P$1 22.23,2.29 23.5,3.56 23.5,11.56 22.23,12.83 v22.23,17.02 22.23,21.34 v20.57,22.99
  pour Top (isolate 0.508): 7.62,29.21 7.62,15.88 19.94,15.88 19.94,20.32 19.05,20.32 19.05,29.21

### Text on the board
tNames: - | MOD-RGB | Only 12VDC | Rev.B | + | + | +12V | RED | GREEN | BLUE
bNames: - | 2 | 1 | 4 | 12VDC | 3 | + | 6 | 5 | 8 | 7 | 10 | 9 | +12V | RED | MOD-RGB | 1 | WWW.OLIMEX.COM/DEV | <C> 2012 | GREEN | 2 | BLUE